# EAGLE schematic Microcontroller Draft (EAGLE 6.4)
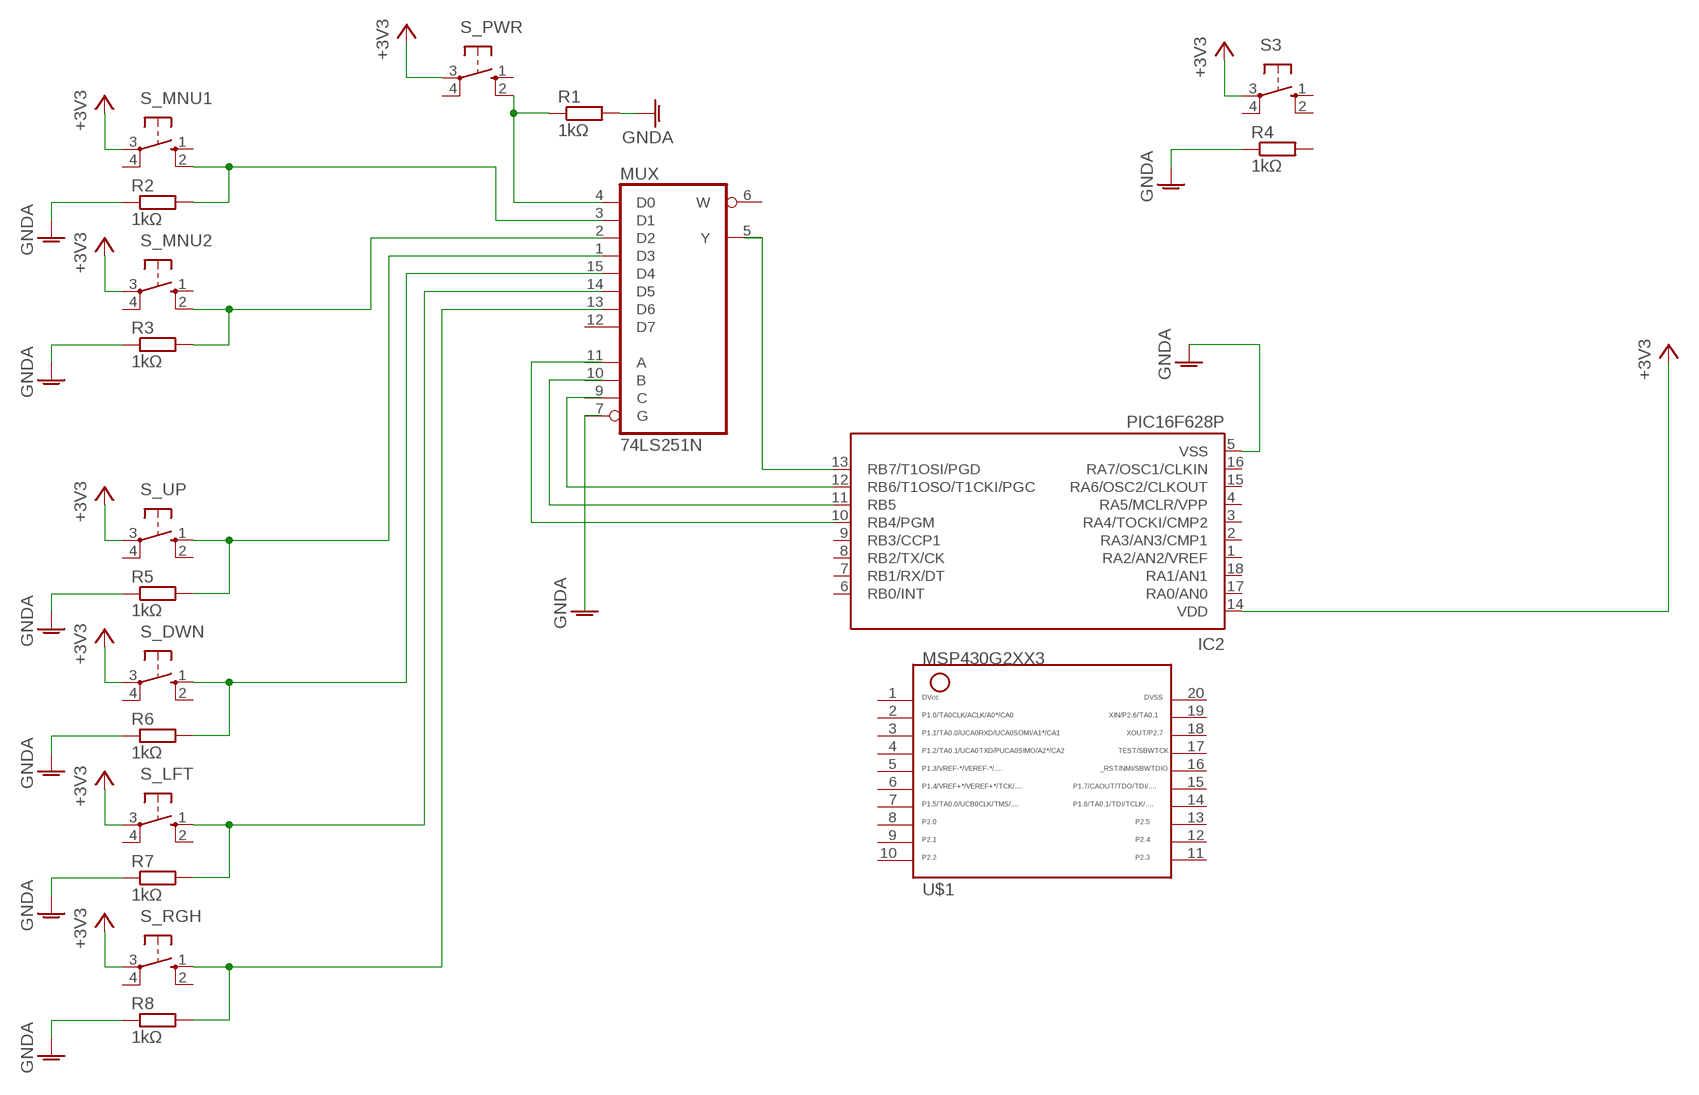
[diagram p0: schematic, sheet 1]

## Parts
IC2  PIC16F628P  [DIL18]
MUX  74LS251N  [DIL16]
R1  1kΩ  R-EU_0207/10  [0207/10]
R2  1kΩ  R-EU_0207/10  [0207/10]
R3  1kΩ  R-EU_0207/10  [0207/10]
R4  1kΩ  R-EU_0207/10  [0207/10]
R5  1kΩ  R-EU_0207/10  [0207/10]
R6  1kΩ  R-EU_0207/10  [0207/10]
R7  1kΩ  R-EU_0207/10  [0207/10]
R8  1kΩ  R-EU_0207/10  [0207/10]
S3  10-XX  [B3F-10XX]
S_DWN  10-XX  [B3F-10XX]
S_LFT  10-XX  [B3F-10XX]
S_MNU1  10-XX  [B3F-10XX]
S_MNU2  10-XX  [B3F-10XX]
S_PWR  10-XX  [B3F-10XX]
S_RGH  10-XX  [B3F-10XX]
S_UP  10-XX  [B3F-10XX]
U$1  G2XX3---N20  [N20]

## Nets
+3V3: IC2.14(VDD) S3.3(P) S_DWN.3(P) S_LFT.3(P) S_MNU1.3(P) S_MNU2.3(P) S_PWR.3(P) S_RGH.3(P) S_UP.3(P)
GNDA: IC2.5(VSS) R1.2 R2.1 R3.1 R4.1 R5.1 R6.1 R7.1 R8.1
N$1: MUX.4(D0) R1.1 S_PWR.2(S1)
N$2: R2.2 S_MNU1.2(S1)
N$3: R8.2 S_RGH.1(S)
N$4: IC2.13(RB7/T1OSI/PGD)
N$5: R7.2 S_LFT.1(S)
N$6: R6.2 S_DWN.1(S)
N$7: R5.2 S_UP.1(S)
N$9: IC2.12(RB6/T1OSO/T1CKI/PGC)
N$10: IC2.11(RB5)
N$11: R3.2 S_MNU2.2(S1)
N$13: IC2.10(RB4/PGM)
Unconnected: IC2.1(RA2/AN2/VREF) IC2.2(RA3/AN3/CMP1) IC2.3(RA4/TOCKI/CMP2) IC2.4(RA5/MCLR/VPP) IC2.6(RB0/INT) IC2.7(RB1/RX/DT) IC2.8(RB2/TX/CK) IC2.9(RB3/CCP1) IC2.15(RA6/OSC2/CLKOUT) IC2.16(RA7/OSC1/CLKIN) IC2.17(RA0/AN0) IC2.18(RA1/AN1) MUX.1(D3) MUX.2(D2) MUX.3(D1) MUX.5(Y) MUX.6(W) MUX.7(G) MUX.9(C) MUX.10(B) MUX.11(A) MUX.12(D7) MUX.13(D6) MUX.14(D5) MUX.15(D4) R4.2 S3.1(S) S3.2(S1) S3.4(P1) S_DWN.2(S1) S_DWN.4(P1) S_LFT.2(S1) S_LFT.4(P1) S_MNU1.1(S) S_MNU1.4(P1) S_MNU2.1(S) S_MNU2.4(P1) S_PWR.1(S) S_PWR.4(P1) S_RGH.2(S1) S_RGH.4(P1) S_UP.2(S1) S_UP.4(P1) U$1.1 U$1.2 U$1.3 U$1.4 U$1.5 U$1.6 U$1.7 U$1.8 U$1.9 U$1.10 U$1.11 U$1.12 U$1.13 U$1.14 U$1.15 U$1.16 U$1.17 U$1.18 U$1.19 U$1.20

## Power pins joined to a net without a drawn wire
GND: MUX.8(GND)
VCC: MUX.16(VCC)

## Library data of the parts
IC2 = microchip:PIC16F62*: FLASH-Based 8-Bit CMOS Microcontroller Source: http://ww1.microchip.com/downloads/en/DeviceDoc/40300C.pdf; MF: MICROCHIP; MPN: PIC16F628-04I/P; OC_FARNELL: 9760407; OC_NEWARK: 19C7272
MUX = 74xx-us:74*251: 1 of 8 data SELECTOR/MULTIPLEXER, 3-state
R1-R8 = resistor:R-EU_: RESISTOR, European symbol
S3 S_DWN S_LFT S_MNU1 S_MNU2 S_PWR S_RGH S_UP = switch-omron:10-XX: OMRON SWITCH; MPN: B3F-1000; OC_FARNELL: 176432; OC_NEWARK: 36M3542
U$1 = TI_MSP430_v16:G2XX3---N20: MSP430G2XX1 PDIP (N) 20 Pin Package